# EAGLE schematic EchidnaShield_000 (EAGLE 6.4)
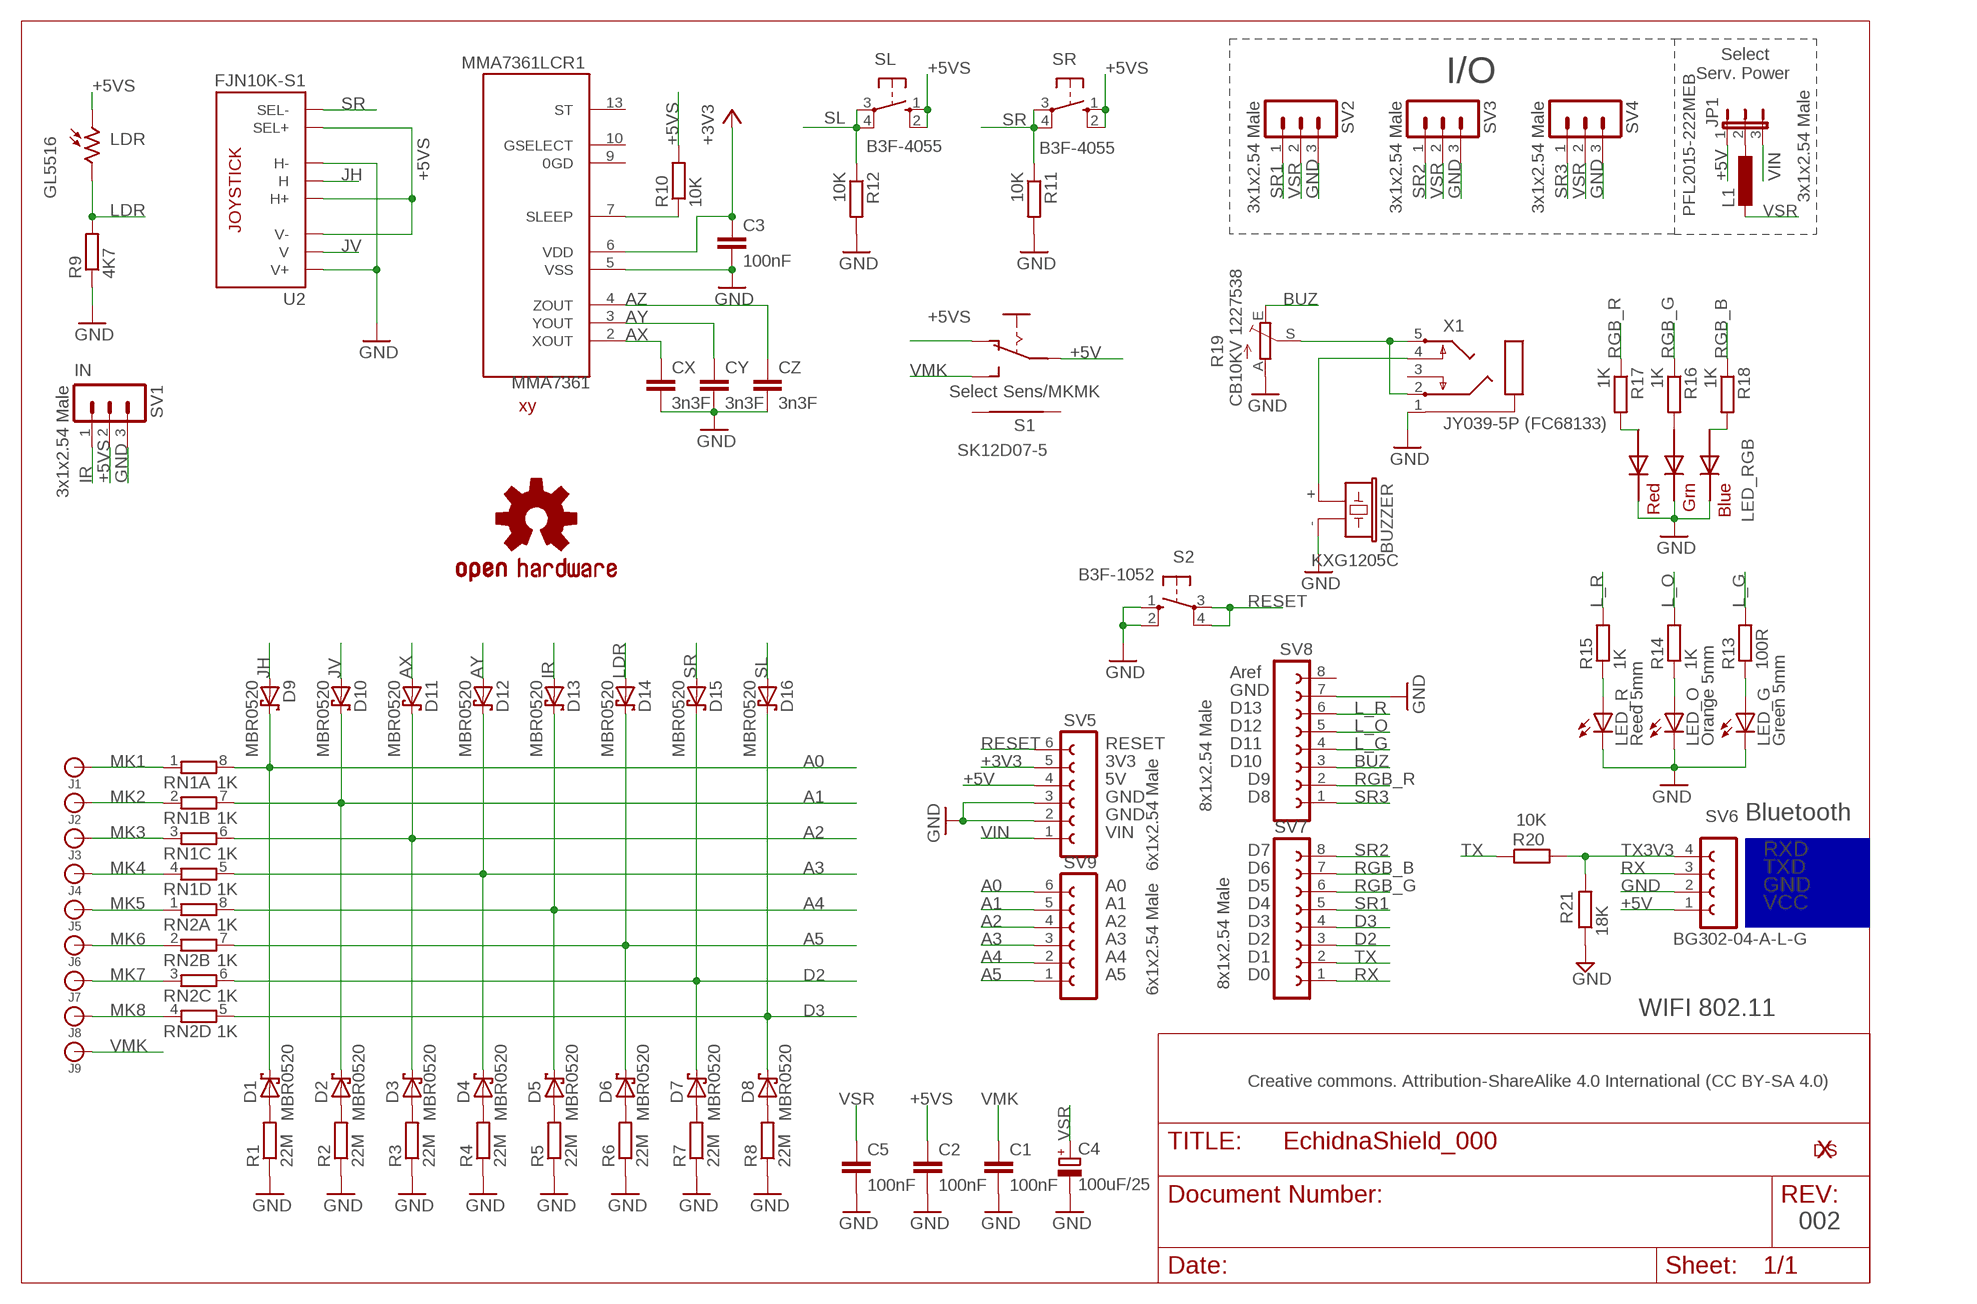
[diagram p0: schematic, sheet 1]

## Parts
BUZZER  KXG1205C  F/CM12P  [F/CM12P]
C1  100nF  C-EUC0603K  [C0603K]
C2  100nF  C-EUC0603K  [C0603K]
C3  100nF  C-EUC0603K  [C0603K]
C4  100uF/25  CPOL-EUD  [PANASONIC_D]
C5  100nF  C-EUC0603K  [C0603K]
CX  3n3F  C-EUC0603K  [C0603K]
CY  3n3F  C-EUC0603K  [C0603K]
CZ  3n3F  C-EUC0603K  [C0603K]
D1  MBR0520  SCHOTTKY-DIODESOD123FL  [SOD123FL]
D2  MBR0520  SCHOTTKY-DIODESOD123FL  [SOD123FL]
D3  MBR0520  SCHOTTKY-DIODESOD123FL  [SOD123FL]
D4  MBR0520  SCHOTTKY-DIODESOD123FL  [SOD123FL]
D5  MBR0520  SCHOTTKY-DIODESOD123FL  [SOD123FL]
D6  MBR0520  SCHOTTKY-DIODESOD123FL  [SOD123FL]
D7  MBR0520  SCHOTTKY-DIODESOD123FL  [SOD123FL]
D8  MBR0520  SCHOTTKY-DIODESOD123FL  [SOD123FL]
D9  MBR0520  SCHOTTKY-DIODESOD123FL  [SOD123FL]
D10  MBR0520  SCHOTTKY-DIODESOD123FL  [SOD123FL]
D11  MBR0520  SCHOTTKY-DIODESOD123FL  [SOD123FL]
D12  MBR0520  SCHOTTKY-DIODESOD123FL  [SOD123FL]
D13  MBR0520  SCHOTTKY-DIODESOD123FL  [SOD123FL]
D14  MBR0520  SCHOTTKY-DIODESOD123FL  [SOD123FL]
D15  MBR0520  SCHOTTKY-DIODESOD123FL  [SOD123FL]
D16  MBR0520  SCHOTTKY-DIODESOD123FL  [SOD123FL]
J1  Hole  BANANA_CONN  [BANANA_CONN]
J2  Hole  BANANA_CONN  [BANANA_CONN]
J3  Hole  BANANA_CONN  [BANANA_CONN]
J4  Hole  BANANA_CONN  [BANANA_CONN]
J5  Hole  BANANA_CONN  [BANANA_CONN]
J6  Hole  BANANA_CONN  [BANANA_CONN]
J7  Hole  BANANA_CONN  [BANANA_CONN]
J8  Hole  BANANA_CONN  [BANANA_CONN]
J9  Hole  BANANA_CONN  [BANANA_CONN]
JP1  3x1x2.54 Male  JUMPER_JP2E  [JUMPER_JP2]
L1  PFL2015-222MEB  L-EUL3216C  [L3216C]
LDR  GL5516  A1060_34  [T0-46-A10XX]
LED_G  Green 5mm  LED5MM  [LED5MM]
LED_O  Orange 5mm  LED5MM  [LED5MM]
LED_R  Reed 5mm  LED5MM  [LED5MM]
LED_RGB  CPL6C-FKBN  [PLCC6]
LOGO1  SPARKFUN-AESTHETICS_OSHW-LOGOL  [SPARKFUN-AESTHETICS_OSHW-LOGO-L]
MMA7361  MMA7361LCR1  MMA7361  [LGA14]
R1  22M  RCL_R-EU_R0603  [RCL_R0603]
R2  22M  RCL_R-EU_R0603  [RCL_R0603]
R3  22M  RCL_R-EU_R0603  [RCL_R0603]
R4  22M  RCL_R-EU_R0603  [RCL_R0603]
R5  22M  RCL_R-EU_R0603  [RCL_R0603]
R6  22M  RCL_R-EU_R0603  [RCL_R0603]
R7  22M  RCL_R-EU_R0603  [RCL_R0603]
R8  22M  RCL_R-EU_R0603  [RCL_R0603]
R9  4K7  RCL_R-EU_R0603  [RCL_R0603]
R10  10K  RCL_R-EU_R0603  [RCL_R0603]
R11  10K  RCL_R-EU_R0603  [RCL_R0603]
R12  10K  RCL_R-EU_R0603  [RCL_R0603]
R13  100R  RCL_R-EU_R0603  [RCL_R0603]
R14  1K  RCL_R-EU_R0603  [RCL_R0603]
R15  1K  RCL_R-EU_R0603  [RCL_R0603]
R16  1K  RCL_R-EU_R0603  [RCL_R0603]
R17  1K  RCL_R-EU_R0603  [RCL_R0603]
R18  1K  RCL_R-EU_R0603  [RCL_R0603]
R19  CB10KV 1227538  TRIM_EU-CA9V  [CA9V]
R20  10K  R-EU_R0603  [R0603]
R21  18K  R-EU_R0603  [R0603]
RN1  1K  RESISTOR-DIL_4R-N0603-ARC  [RESISTOR-DIL_0603-ARC]
RN2  1K  RESISTOR-DIL_4R-N0603-ARC  [RESISTOR-DIL_0603-ARC]
S1  SK12D07-5  ESCORNA_SK12F14D  [ESCORNA_SK-12D07]
S2  B3F-1052  SWITCH-OMRON_10-XX  [SWITCH-OMRON_B3F-10XX]
SL  B3F-4055  40-XX  [B3F-40XX]
SR  B3F-4055  40-XX  [B3F-40XX]
SV1  3x1x2.54 Male  MA03-1  [MA03-1]
SV2  3x1x2.54 Male  MA03-1  [MA03-1]
SV3  3x1x2.54 Male  MA03-1  [MA03-1]
SV4  3x1x2.54 Male  MA03-1  [MA03-1]
SV5  6x1x2.54 Male  FE06-1  [FE06]
SV6  BG302-04-A-L-G  FE04W  [FE04W]
SV7  8x1x2.54 Male  FE08-1  [FE08]
SV8  8x1x2.54 Male  FE08-1  [FE08]
SV9  6x1x2.54 Male  FE06-1  [FE06]
U2  FJN10K-S1  JOYSTICKPTH  [JOYSTICK]
U$2  XY  [XY]
U$5  XDESIG21  [XDESIG]
X1  JY039-5P (FC68133)  STEREOJACK  [STX3100]

## Nets
+3V3: C3.1 MMA7361.6(VDD) SV5.5
+5V: JP1.1 S1.P$1(P) SV5.4 SV6.1
+5VS: C2.1 LDR.1 R10.2 S1.P$2(O) SL.1(S) SL.2(S1) SR.1(S) SR.2(S1) SV1.2 U2.B1A(SEL+) U2.H1(H+) U2.V3(V-)
A0: D1.C D9.C RN1.8 SV9.6
A1: D2.C D10.C RN1.7 SV9.5
A2: D3.C D11.C RN1.6 SV9.4
A3: D4.C D12.C RN1.5 SV9.3
A4: D5.C D13.C RN2.8 SV9.2
A5: D6.C D14.C RN2.7 SV9.1
AX: CX.1 D11.A MMA7361.2(XOUT)
AY: CY.1 D12.A MMA7361.3(YOUT)
AZ: CZ.1 MMA7361.4(ZOUT)
BUZ: R19.E SV8.3
D2: D7.C D15.C RN2.6 SV7.3
D3: D8.C D16.C RN2.5 SV7.4
GND: BUZZER.- C1.2 C2.2 C3.2 C4.- C5.2 CX.2 CY.2 CZ.2 LED_G.K(C) LED_O.K(C) LED_R.K(C) LED_RGB.4(BLUE_C) LED_RGB.5(GREEN_C) LED_RGB.6(RED_C) MMA7361.5(VSS) R1.1 R2.1 R3.1 R4.1 R5.1 R6.1 R7.1 R8.1 R9.1 R11.2 R12.2 R19.A R21.1 S2.1(S) S2.2(S1) SV1.3 SV2.3 SV3.3 SV4.3 SV5.2 SV5.3 SV6.2 SV8.7 U2.H3(H-) U2.V1(V+) X1.1
IR: D13.A SV1.1
JH: D9.A U2.H2(H)
JV: D10.A U2.V2(V)
L_G: R13.2 SV8.4
L_O: R14.2 SV8.5
L_R: R15.2 SV8.6
LDR: D14.A LDR.2 R9.2
MK1: J1.P$1 RN1.1
MK2: J2.P$1 RN1.2
MK3: J3.P$1 RN1.3
MK4: J4.P$1 RN1.4
MK5: J5.P$1 RN2.1
MK6: J6.P$1 RN2.2
MK7: J7.P$1 RN2.3
MK8: J8.P$1 RN2.4
N$1: D1.A R1.2
N$2: D2.A R2.2
N$3: D3.A R3.2
N$4: D4.A R4.2
N$5: D5.A R5.2
N$6: D6.A R6.2
N$7: D7.A R7.2
N$8: D8.A R8.2
N$9: R19.S X1.2 X1.5
N$10: BUZZER.+ X1.4
N$11: LED_RGB.2(GREEN_A) R16.2
N$15: JP1.2 L1.1
N$23: LED_RGB.1(RED_A) R17.2
N$24: LED_RGB.3(BLUE_A) R18.2
N$25: LED_G.A R13.1
N$26: LED_O.A R14.1
N$28: LED_R.A R15.1
N$48: MMA7361.7(SLEEP) R10.1
RESET: S2.3(P) S2.4(P1) SV5.6
RGB_B: R18.1 SV7.7
RGB_G: R16.1 SV7.6
RGB_R: R17.1 SV8.2
RX: SV6.3 SV7.1
SL: D16.A R12.1 SL.3(P) SL.4(P1)
SR: D15.A R11.1 SR.3(P) SR.4(P1) U2.B2A(SEL-)
SR1: SV2.1 SV7.5
SR2: SV3.1 SV7.8
SR3: SV4.1 SV8.1
TX: R20.1 SV7.2
TX3V3: R20.2 R21.2 SV6.4
VIN: JP1.3 SV5.1
VMK: C1.1 J9.P$1 S1.P$3(S)
VSR: C4.+ C5.1 L1.2 SV2.2 SV3.2 SV4.2
Unconnected: MMA7361.9(0GD) MMA7361.10(GSELECT) MMA7361.13(ST) S1.P$4 S1.P$5 SV8.8 X1.3

## Notes on the sheet
- I/O
- Select
  Serv. Power
- IN
- Select Sens/MKMK
- Aref
- GND
- D13
- D12
- RESET | D11
- 3V3 | D10
- 5V | D9
- GND | D8
- GND | Bluetooth
- VIN
- D7 | RXD
- D6 | TXD
- A0 | D5 | GND
- A1 | D4 | VCC
- A2 | D3
- A3 | D2
- A4 | D1
- A5 | D0
- WIFI 802.11
- Creative commons. Attribution-ShareAlike 4.0 International (CC BY-SA 4.0)
- 002

## Library data of the parts
BUZZER = buzzer:F/CM12P: BUZZER Source: Buerklin; OC_FARNELL: unknown; OC_NEWARK: unknown
C1-C3 C5 CX CY CZ = rcl:C-EU: CAPACITOR, European symbol
C4 = rcl:CPOL-EU: POLARIZED CAPACITOR, European symbol
D1-D16 = diode:SCHOTTKY-DIODE: Schottky Diode
J1-J9 = SparkFun-Connectors:BANANA_CONN: Through-hole banana jack
JP1 = escorna_ELIB:JUMPER_JP2E: JUMPER
L1 = rcl:L-EU: INDUCTOR, European symbol
LDR = photo-elements:A10: Sensor Robust Light Sensing Applications Outdoor Light Sensing Application Source: http://optoelectronics.perkinelmer.com/content/Datasheets/DTS_PhotocellsA1050.pdf
LED_G LED_O LED_R = led:LED: LED OSRAM: - CHIPLED LG R971, LG N971, LY N971, LG Q971, LY Q971, LO R971, LY R971 LH N974, LH R974 LS Q976, LO Q976, LY Q976 LO Q996 - Hyper CHIPLED LW Q18S LB Q993, LB Q99A, LB R99A - SideLED LS A670, LO A670, LY A670, LG A670, LP A670 LB A673, LV A673, LT A673, LW A673 LH A674 LY A675 LS A676, LA A676, LO A676, LY A676, LW A676 LS A679, LY A679, LG A679 - Hyper Micro SIDELED® LS Y876, LA Y876, LO Y876, LY Y876 LT Y87S - SmartLED LW L88C, LW L88S LB L89C, LB L89S, LG L890 LS L89K, LO L89K, LY L89K LS L896, LA L896, LO L896, LY L896 - TOPLED LS T670, LO T670, LY T670, LG T670, LP T670 LSG T670, LSP T670, LSY T670, LOP T670, LYG T670 LG T671, LOG T671, LSG T671 LB T673, LV T673, LT T673, LW T673 LH T674 LS T676, LA T676, LO T676, LY T676, LB T676, LH T676, LSB T676, LW T676 LB T67C, LV T67C, LT T67C, LS T67K, LO T67K, LY T67K, LW E67C LS E67B, LA E67B, LO E67B, LY E67B, LB E67C, LV E67C, LT E67C LW T67C LS T679, LY T679, LG T679 LS T770, LO T770, LY T770, LG T770, LP T770 LB T773, LV T773, LT T773, LW T773 LH T774 LS E675, LA E675, LY E675, LS T675 LS T776, LA T776, LO T776, LY T776, LB T776 LHGB T686 LT T68C, LB T68C - Hyper Mini TOPLED® LB M676 - Mini TOPLED Santana® LG M470 LS M47K, LO M47K, LY M47K Source: http://www.osram.convergy.de LUXEON: - LUMILED® LXK2-PW12-R00, LXK2-PW12-S00, LXK2-PW14-U00, LXK2-PW14-V00 LXK2-PM12-R00, LXK2-PM12-S00, LXK2-PM14-U00 LXK2-PE12-Q00, LXK2-PE12-R00, LXK2-PE12-S00, LXK2-PE14-T00, LXK2-PE14-U00 LXK2-PB12-K00, LXK2-PB12-L00, LXK2-PB12-M00, LXK2-PB14-N00, LXK2-PB14-P00, LXK2-PB14-Q00 LXK2-PR12-L00, LXK2-PR12-M00, LXK2-PR14-Q00, LXK2-PR14-R00 LXK2-PD12-Q00, LXK2-PD12-R00, LXK2-PD12-S00 LXK2-PH12-R00, LXK2-PH12-S00 LXK2-PL12-P00, LXK2-PL12-Q00, LXK2-PL12-R00 Source: www.luxeon.com KINGBRIGHT: KA-3528ASYC Source: www.kingbright.com
LED_RGB = Echidna_shield_LBR:CPL6C-FKB
LOGO1 = escorna_LBREscorna_CPU_2_10:SPARKFUN-AESTHETICS_OSHW-LOGO: Open Source Hardware Logo This logo indicates the piece of hardware it is found on incorporates a OSHW license and/or adheres to the definition of open source hardware found here: http://freedomdefined.org/OSHW
MMA7361 = SparkFun-Sensors:MMA7361: 3-axis 1.5/6g analog output accelerometer IC-09489; PROD_ID: IC-09489; VALUE: IC-09489
R1-R18 = escorna_LBREscorna_CPU_2_10:RCL_R-EU_: RESISTOR, European symbol
R19 = pot:TRIM_EU-: POTENTIOMETER
R20 R21 = rcl:R-EU_: RESISTOR, European symbol
RN1 RN2 = escorna_LBREscorna_CPU_2_10:RESISTOR-DIL_4R-N: Array Chip Resistor Source: RS Component / Phycomp; OC_FARNELL: unknown; OC_NEWARK: unknown
S1 = escorna_ELIB:ESCORNA_SK12F14
S2 = escorna_ELIB:SWITCH-OMRON_10-XX: OMRON SWITCH; MPN: B3F-1000; OC_FARNELL: 176432; OC_NEWARK: 36M3542
SL SR = Pulsadores Juan García:40-XX: OMRON SWITCH; MF: OMRON COMPONENTS USA; MPN: B3F-4000; OC_FARNELL: 176434; OC_NEWARK: 36K3105
SV1-SV4 = con-lstb:MA03-1: PIN HEADER; OC_FARNELL: unknown; OC_NEWARK: unknown
SV5 SV9 = con-lsta:FE06-1: FEMALE HEADER; OC_FARNELL: unknown; OC_NEWARK: unknown
SV6 = con-lsta:FE04W
SV7 SV8 = con-lsta:FE08-1: FEMALE HEADER; OC_FARNELL: unknown; OC_NEWARK: unknown
U2 = Juan Garcia-Electromechanical:JOYSTICK: Thumb Joystick Joystick commonly found in PS2 controllers. Two pots and a select switch. Footprint proven. Spark Fun Electronics SKU : COM-09032
U$2 = xdesig:XY
U$5 = xdesig:XDESIG
X1 = adafruit:STEREOJACK: MIC/HEADPHONE JACK Stereo jack with two switches. Kycon STX3100, CUI SJ1-3555NG and/or 4UCon 05544

## Net classes
0 default: width 0.254 mm, drill 0.61 mm, clearance 0.254 mm